# EAGLE schematic VoiceRecognition_Team3 (EAGLE 9.2.1)
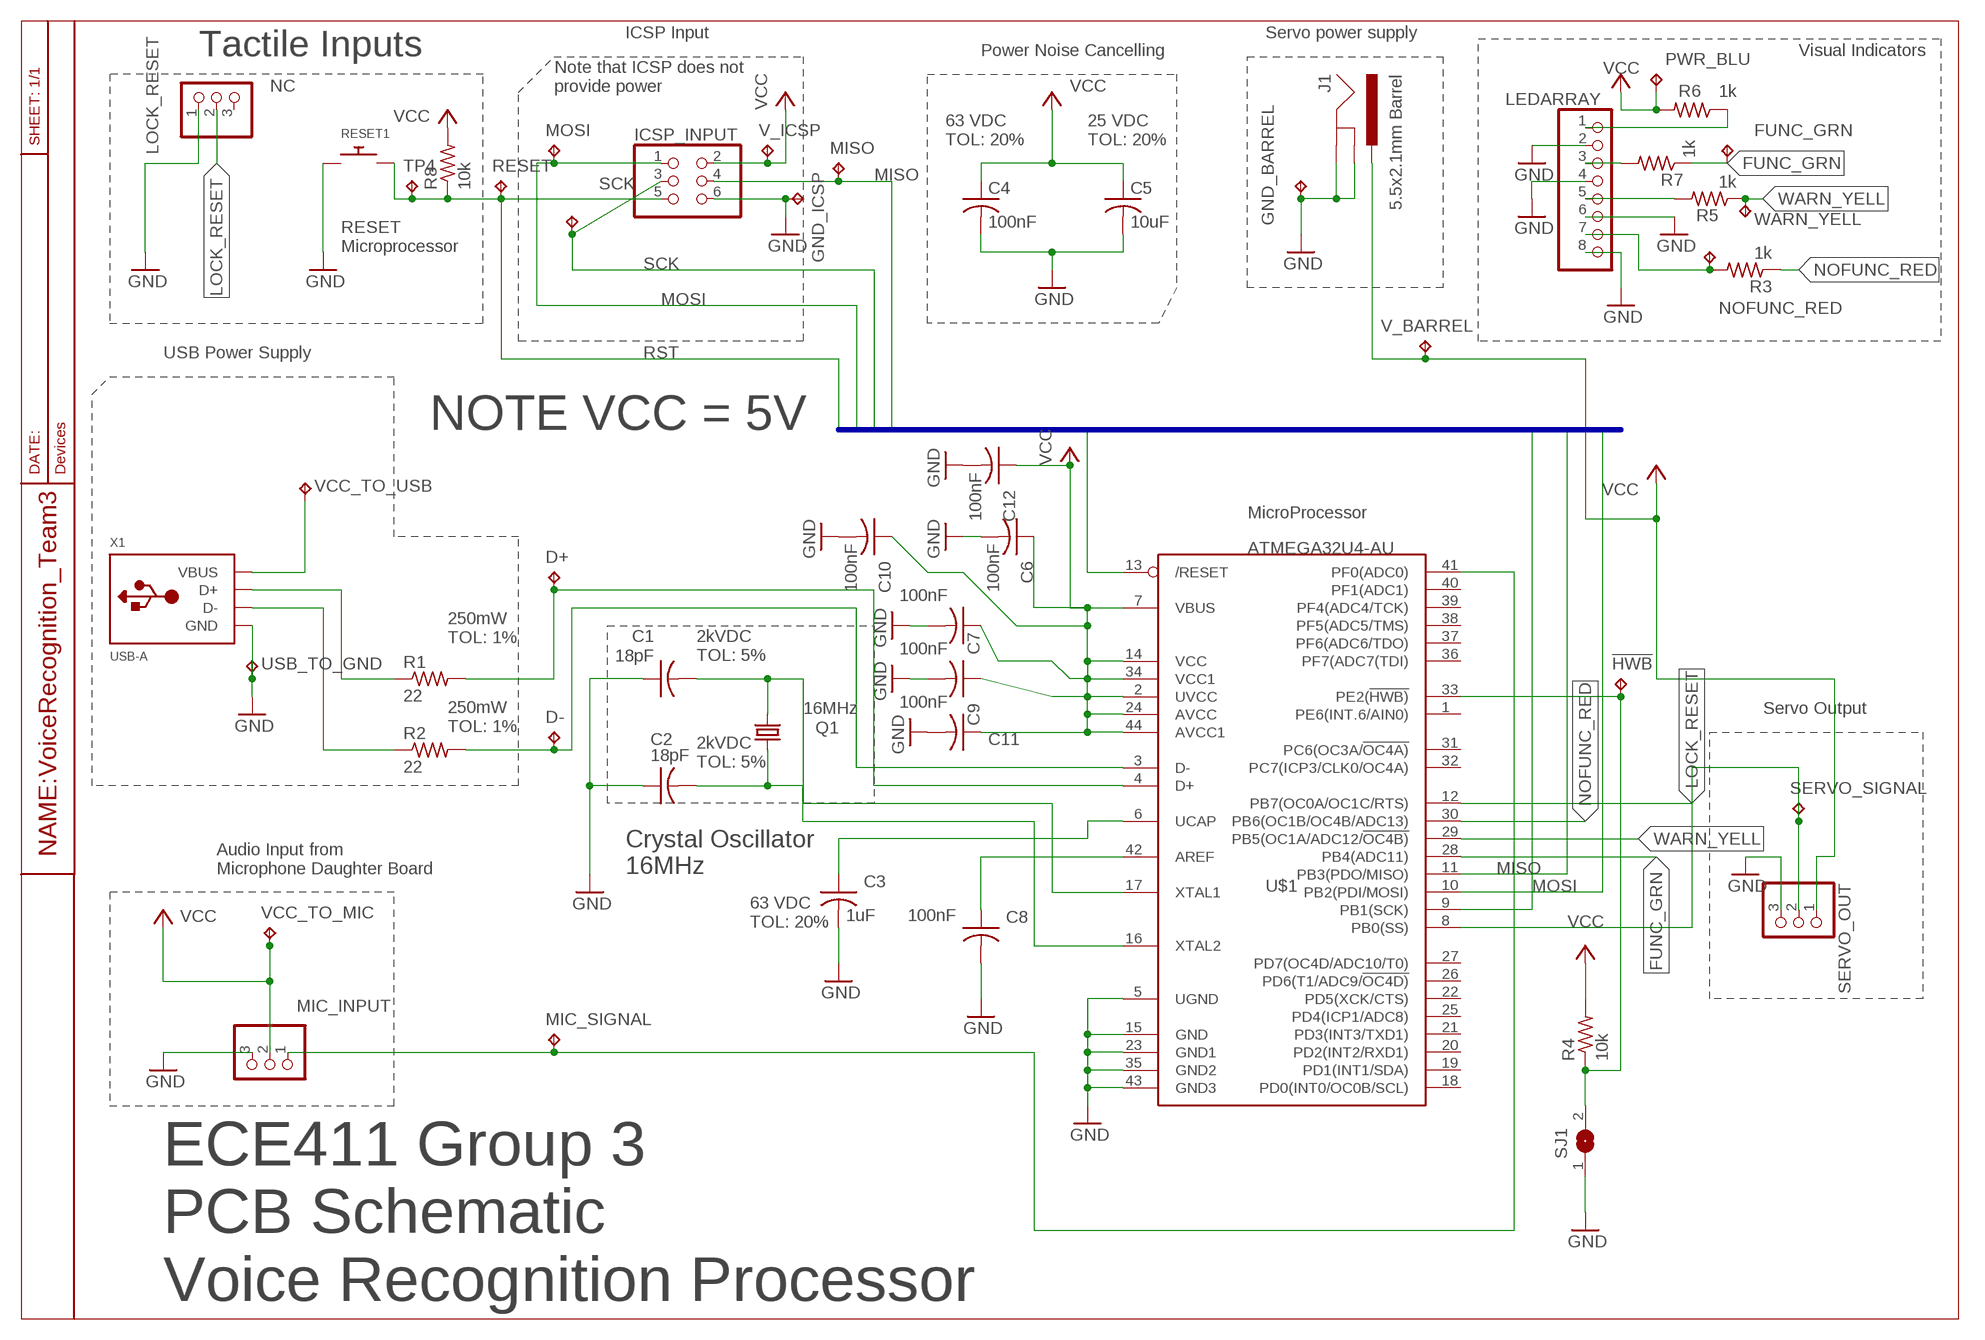
[diagram p0: schematic, sheet 1]

## Parts
!HWB  TPTP15SQ  [TP15SQ]
C1  18pF  C-USC1206  [C1206]
C2  18pF  C-USC1206  [C1206]
C3  1uF  C-USC1206  [C1206]
C4  100nF  C-USC1206  [C1206]
C5  10uF  C-USC1206  [C1206]
C6  100nF  C-USC1206  [C1206]
C7  100nF  C-USC1206  [C1206]
C8  100nF  C-USC1206  [C1206]
C9  100nF  C-USC1206  [C1206]
C10  100nF  C-USC1206  [C1206]
C11  100nF  C-USC1206  [C1206]
C12  100nF  C-USC1206  [C1206]
D+  TPTP15SQ  [TP15SQ]
D-  TPTP15SQ  [TP15SQ]
FUNC_GRN  TPTP15SQ  [TP15SQ]
GND_BARREL  TPTP15SQ  [TP15SQ]
GND_ICSP  TPTP15SQ  [TP15SQ]
ICSP_INPUT  PINHD-2X3  [2X03]
J1  5.5x2.1mm Barrel  POWER_JACKSMD  [POWER_JACK_SMD]
LEDARRAY  PINHD-1X8BIG  [1X08-BIG]
LOCK_RESET  PINHD-1X3  [1X03]
MIC_INPUT  PINHD-1X3  [1X03]
MIC_SIGNAL  TPTP15SQ  [TP15SQ]
MISO  TPTP15SQ  [TP15SQ]
MOSI  TPTP15SQ  [TP15SQ]
NOFUNC_RED  TPTP15SQ  [TP15SQ]
PWR_BLU  TPTP15SQ  [TP15SQ]
Q1  16MHz  CRYSTALCTS406  [CTS406]
R1  22  R-US_M1206  [M1206]
R2  22  R-US_M1206  [M1206]
R3  1k  R-US_M1206  [M1206]
R4  10k  R-US_M1206  [M1206]
R5  1k  R-US_M1206  [M1206]
R6  1k  R-US_M1206  [M1206]
R7  1k  R-US_M1206  [M1206]
R8  10k  R-US_M1206  [M1206]
RESET  TPTP15SQ  [TP15SQ]
RESET1  SWITCH_PUSHBUTTONC&K_KSS  [BTN_CK_KSS]
SCK  TPTP15SQ  [TP15SQ]
SERVO_OUT  PINHD-1X3  [1X03]
SERVO_SIGNAL  TPTP15SQ  [TP15SQ]
SJ1  SJW  [SJW]
TP4  TPTP15SQ  [TP15SQ]
U$1  ATMEGA32U4-AU  [TQFP44]
USB_TO_GND  TPTP15SQ  [TP15SQ]
V_BARREL  TPTP15SQ  [TP15SQ]
V_ICSP  TPTP15SQ  [TP15SQ]
VCC_TO_MIC  TPTP15SQ  [TP15SQ]
VCC_TO_USB  TPTP15SQ  [TP15SQ]
WARN_YELL  TPTP15SQ  [TP15SQ]
X1  USB-A  [MOLEX_480371000]

## Nets
FUNC_GRN: FUNC_GRN.TP LEDARRAY.3 R7.1 R7.2 U$1.28(PB4(ADC11))
GND: C1.1 C2.1 C3.2 C4.2 C5.2 C6.2 C7.2 C8.2 C9.2 C10.2 C11.2 C12.2 GND_BARREL.TP GND_ICSP.TP ICSP_INPUT.6 J1.GND(GNDBREAK) J1.P$4(GND) LEDARRAY.2 LEDARRAY.4 LEDARRAY.6 LEDARRAY.8 LOCK_RESET.1 MIC_INPUT.3 RESET1.P$1 SERVO_OUT.3 SJ1.1 U$1.5(UGND) U$1.15(GND) U$1.23(GND1) U$1.35(GND2) U$1.43(GND3) USB_TO_GND.TP X1.4(GND)
HWB: !HWB.TP R4.1 SJ1.2 U$1.33(PE2(!HWB))
LOCK_RESET: LOCK_RESET.2 U$1.12(PB7(OC0A/OC1C/RTS))
MIC_SIGNAL: MIC_INPUT.1 MIC_SIGNAL.TP U$1.41(PF0(ADC0))
MISO: ICSP_INPUT.4 MISO.TP U$1.11(PB3(PDO/MISO))
MOSI: ICSP_INPUT.1 MOSI.TP U$1.10(PB2(PDI/MOSI))
N$1: C3.1 U$1.6(UCAP)
N$3: R1.1 X1.3(D+)
N$4: LEDARRAY.1 R6.1
N$5: LEDARRAY.5 R5.2
N$6: LEDARRAY.7 NOFUNC_RED.TP R3.2
N$7: VCC_TO_USB.TP X1.1(VBUS)
N$9: R2.1 X1.2(D-)
N$12: D+.TP R1.2 U$1.4(D+)
N$14: C8.1 U$1.42(AREF)
N$16: C1.2 Q1.3 U$1.17(XTAL1)
N$20: D-.TP R2.2 U$1.3(D-)
N$22: C2.2 Q1.1 U$1.16(XTAL2)
NOFUNC_RED: R3.1 U$1.30(PB6(OC1B/OC4B/ADC13))
RST: ICSP_INPUT.5 R8.1 RESET1.P$2 RESET.TP TP4.TP U$1.13(/RESET)
SCK: ICSP_INPUT.3 SCK.TP U$1.9(PB1(SCK))
SIGNAL: SERVO_OUT.2 SERVO_SIGNAL.TP U$1.8(PB0(SS))
VCC: C4.1 C5.1 C6.1 C7.1 C9.1 C10.1 C11.1 C12.1 ICSP_INPUT.2 J1.VIN0(PWR) MIC_INPUT.2 PWR_BLU.TP R4.2 R6.2 R8.2 SERVO_OUT.1 U$1.2(UVCC) U$1.7(VBUS) U$1.14(VCC) U$1.24(AVCC) U$1.34(VCC1) U$1.44(AVCC1) V_BARREL.TP V_ICSP.TP VCC_TO_MIC.TP
WARN_YELL: R5.1 U$1.29(PB5(OC1A/ADC12/!OC4B)) WARN_YELL.TP
Unconnected: LOCK_RESET.3 U$1.1(PE6(INT.6/AIN0)) U$1.18(PD0(INT0/OC0B/SCL)) U$1.19(PD1(INT1/SDA)) U$1.20(PD2(INT2/RXD1)) U$1.21(PD3(INT3/TXD1)) U$1.22(PD5(XCK/CTS)) U$1.25(PD4(ICP1/ADC8)) U$1.26(PD6(T1/ADC9/!OC4D)) U$1.27(PD7(OC4D/ADC10/T0)) U$1.31(PC6(OC3A/!OC4A)) U$1.32(PC7(ICP3/CLK0/OC4A)) U$1.36(PF7(ADC7(TDI)) U$1.37(PF6(ADC6/TDO)) U$1.38(PF5(ADC5/TMS)) U$1.39(PF4(ADC4/TCK)) U$1.40(PF1(ADC1))

## Buses
MISO,MOSI,RST,SCK

## Notes on the sheet
- ICSP Input | Servo power supply
- Tactile Inputs | Power Noise Cancelling | Visual Indicators
- NC
- Note that ICSP does not
  provide power
- 63 VDC
  TOL: 20%
- 25 VDC
  TOL: 20%
- RESET 
  Microprocessor
- USB Power Supply
- NOTE VCC = 5V
- MicroProcessor
- 250mW
  TOL: 1%
- 2kVDC
  TOL: 5%
- Servo Output
- 250mW
  TOL: 1%
- 2kVDC
  TOL: 5%
- Audio Input from 
  Microphone Daughter Board
- Crystal Oscillator
  16MHz
- 63 VDC
  TOL: 20%
- ECE411 Group 3
  PCB Schematic
  Voice Recognition Processor

## Library data of the parts
!HWB D+ D- FUNC_GRN GND_BARREL GND_ICSP MIC_SIGNAL MISO MOSI NOFUNC_RED PWR_BLU RESET SCK SERVO_SIGNAL TP4 USB_TO_GND V_BARREL V_ICSP VCC_TO_MIC VCC_TO_USB WARN_YELL = testpad:TP: Test pad
C1-C12 = rcl:C-US: CAPACITOR, American symbol; SPICEPREFIX: C
ICSP_INPUT = pinhead:PINHD-2X3: PIN HEADER
J1 = SparkFun-Connectors:POWER_JACK: Power Jack Connector This is the standard 5.5mm barrel jack for power. The PTH is the most common, proven, reliable, footprint. The Slot footprint only works if the mill layer is transmitted to the PCB fab house so be warned. Here are the connectors we sell at SparkFun: DC Barrel Power Jack/Connector <https://www.sparkfun.com/products/119> (PRT-00119) DC Barrel Power Jack/Connector (SMD) <https://www.sparkfun.com/products/12748> (PRT-12748) DC Barrel Jack Adapter - Breadboard Compatible <https://www.sparkfun.com/products/10811> (PRT-10811) It is used on this SparkFun product (and many, many others): SparkFun RedBoard - Programmed with Arduino <https://www.sparkfun.com/products/12757> (DEV-12757) Also, if you need a mating power supply or connector, please check these out: Wall Adapter Power Supply - 9VDC 650mA <https://www.sparkfun.com/products/298> (TOL-00298) DC Barrel Jack Adapter - Male <https://www.sparkfun.com/products/10287> (PRT-10287); PROD_ID: CONN-08106; SF_ID: PRT-12748
LEDARRAY = adafruit:PINHD-1X8: PIN HEADER
LOCK_RESET = adafruit:PINHD-1X3: PIN HEADER
MIC_INPUT SERVO_OUT = pinhead:PINHD-1X3: PIN HEADER
Q1 = adafruit:CRYSTAL: CRYSTAL; OC_FARNELL: unknown; OC_NEWARK: unknown
R1-R8 = rcl:R-US_: RESISTOR, American symbol; SPICEPREFIX: R
RESET1 = adafruit:SWITCH_PUSHBUTTON: Buttons SOFTTOUCHSMD_SJ - Soft touch temporary push button (Super Junk Akihabara) Compatible with SKPMANE010 [Mouser: 688-SKPMAN] C&K_KSS = Digikey: KSS221GLFS
SJ1 = jumper:SJ: SMD solder JUMPER
U$1 = adafruit:ATMEGA32U4: http://www.ladyada.net/library/eagle
X1 = adafruit:USB-A: USB type A 'plug' Used for things that can directly connect to a USB port, say USB key